# Altium project Kenwood-TS50s-Digi-Interface.PrjPcb
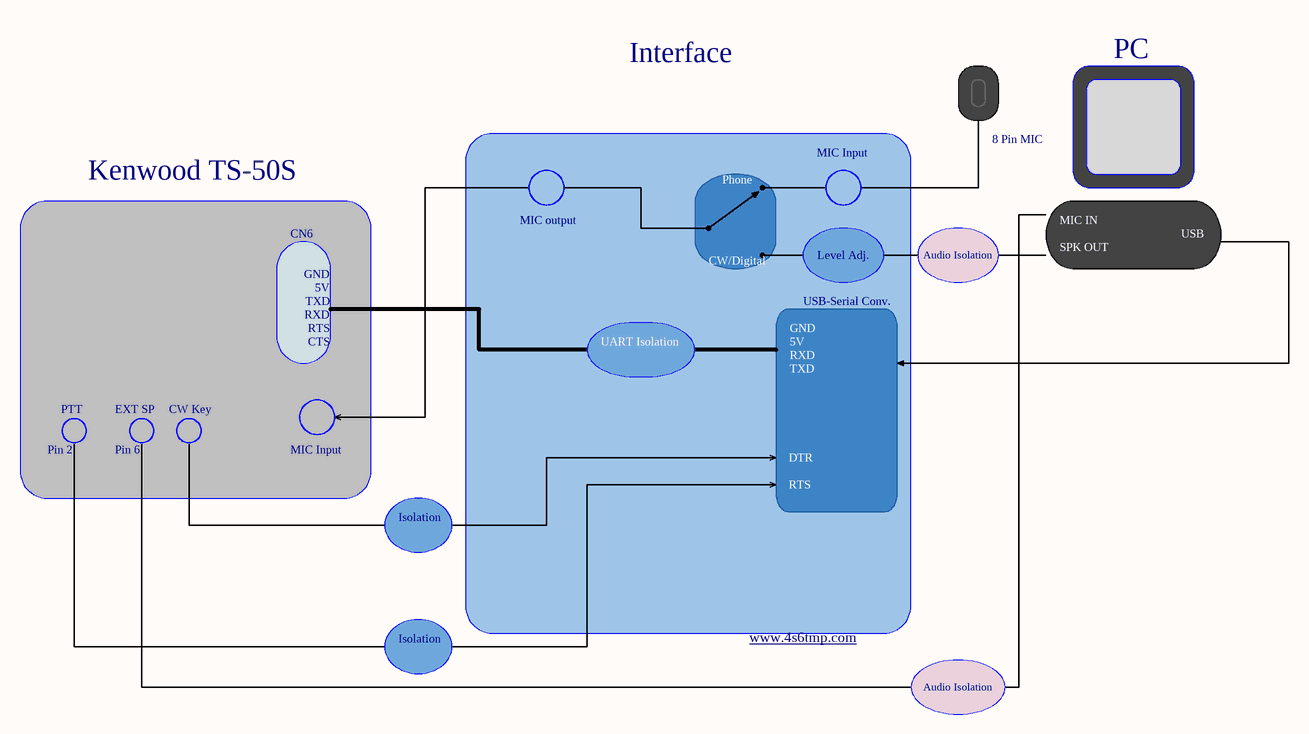
[diagram p0: Block Diagram.SchDoc]
4 sheets, 53 parts. Net scope: global (net labels, ports and power ports of the same name join across sheets).
Board files: ts-50s-digi-interface.PcbDoc, bottomplate.PcbDoc, faceplate.PcbDoc, PCB_panel.PcbDoc
Sheets:
  Block Diagram.SchDoc
  CAT-PTT.SchDoc
  Hardware.SchDoc
  ts-50s-digi-interface.SchDoc

## Sheet Block Diagram.SchDoc: Block Diagram
size A4; DocumentNumber: 1; Revision: 1; SheetNumber: 1; SheetTotal: 4

### Notes on the sheet
- Interface
- PC
- Kenwood TS-50S
- Phone
- MIC Input
- 8 Pin MIC
- CN6
- MIC output
- CW/Digital
- Level Adj.
- Audio Isolation
- MIC IN
- SPK OUT
- USB
- GND
- RXD
- TXD
- RTS
- 5V
- USB-Serial Conv.
- CTS
- UART Isolation
- Pin 2
- PTT
- EXT SP
- Pin 6
- CW Key
- DTR
- Isolation
- www.4s6tmp.com <http://www.4s6tmp.com>
- Title
- Size:
- Date:
- A4
- Number:
- Time:
- Revision:
- Sheet
- of
- File:

## Sheet CAT-PTT.SchDoc: TS50S USB CAT
size A4; DocumentNumber: 2; Revision: 1; SheetNumber: 2; SheetTotal: 4
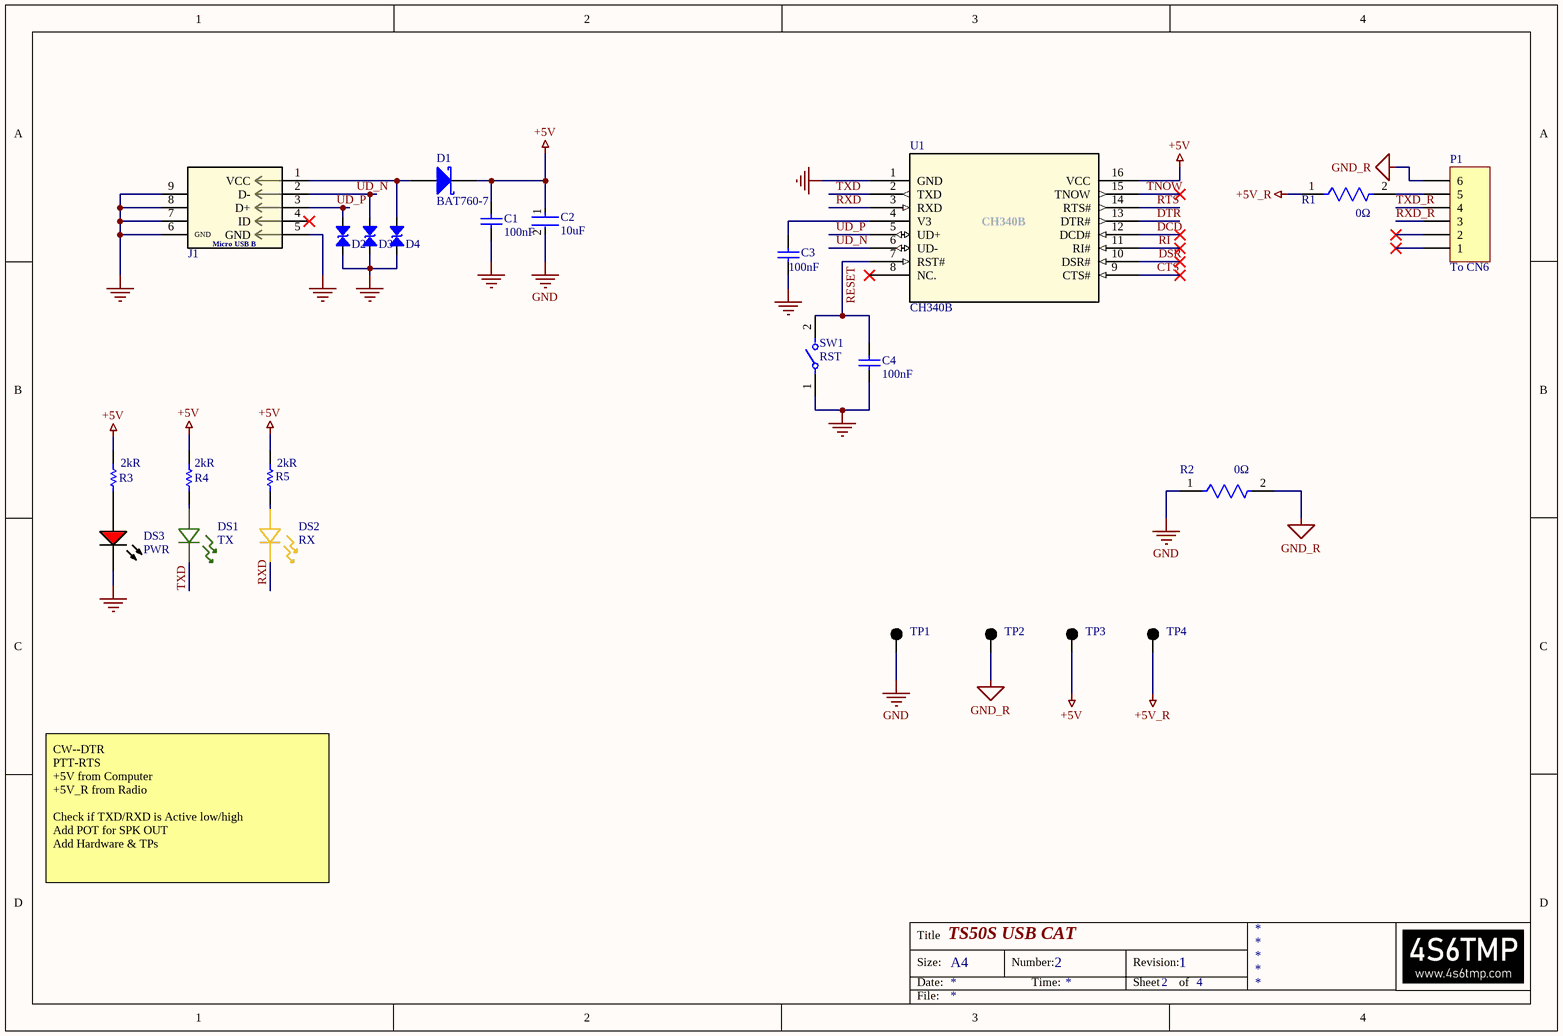
[diagram p1: CAT-PTT.SchDoc]

### Parts
C1  100nF  [CAPC1608X90X35ML10T15]
C2  10uF  [FP-GRM188-0_1-e0_2_0_55-IPC_A]
C3  100nF  [CAPC1608X90X35ML10T15]
C4  100nF  [CAPC1608X90X35ML10T15]
D1  BAT760-7  [SOD323_DIO]
D2  ESD Diode  [0603ESDA-05N]  (value not drawn)
D3  ESD Diode  [0603ESDA-05N]  (value not drawn)
D4  ESD Diode  [0603ESDA-05N]  (value not drawn)
DS1  TX  [LED_19-217/GHC-YR1S2/3T_EVE]
DS2  RX  [LED_19-217/GHC-YR1S2/3T_EVE]
DS3  PWR  [EVRL-0603-2_V]
J1  U254-051N-4BH806  [CONN_10103594-0001LF_AMP]  (value not drawn)
P1  To CN6  [HDR1X6]
R1  0Ω  [FP-RC0603-MFG]
R2  0Ω  [FP-RC0603-MFG]
R3  2kR  [RESC1608X55X25NL10T15]
R4  2kR  [RESC1608X55X25NL10T15]
R5  2kR  [RESC1608X55X25NL10T15]
SW1  RST  [FP-B3U-1000P-B-MFG]
TP1  GND  [KSTN-5001]  (value not drawn)
TP2  GND_R  [KSTN-5001]  (value not drawn)
TP3  +5V  [KSTN-5001]  (value not drawn)
TP4  +5V_R  [KSTN-5001]  (value not drawn)
U1  CH340B  [SOIC-16]

### Nets
+5V: C1.2 C2.1 D1.1(K) R3.2 R4.2 R5.2 TP3.1 U1.16(VCC)
+5V_R: R1.1 TP4.1
GND: C1.1 C2.2 C3.2 C4.1 D2.2 D3.2 D4.2 DS3.2(K) J1.5(GND) J1.6(GND) J1.7(GND) J1.8(GND) J1.9(GND) R2.1 SW1.1 TP1.1 U1.1(GND)
GND_R: P1.6 R2.2 TP2.1
CTS: U1.9(CTS#)
DCD: U1.12(DCD#)
DSR: U1.10(DSR#)
DTR: U1.13(DTR#)
RESET: C4.2 SW1.2 U1.7(RST#)
RI: U1.11(RI#)
RTS: U1.14(RTS#)
RXD: DS2.1 U1.3(RXD)
RXD_R: P1.3
TNOW: U1.15(TNOW)
TXD: DS1.1 U1.2(TXD)
TXD_R: P1.4
UD_N: D3.1 J1.2(D-) U1.6(UD-)
UD_P: D2.1 J1.3(D+) U1.5(UD+)
NetC3_1: C3.1 U1.4(V3)
NetD1_2: D1.2(A) D4.1 J1.1(VCC)
NetDS1_2: DS1.2 R4.1
NetDS2_2: DS2.2 R5.1
NetDS3_1: DS3.1(A) R3.1
NetP1_5: P1.5 R1.2

Not connected (* = marked no-connect by the designer): J1 4(ID)*; P1 1* 2*; U1 8(NC.)*

### Notes on the sheet
- CW--DTR
  PTT-RTS
  +5V from Computer
  +5V_R from Radio
  Check if TXD/RXD is Active low/high
  Add POT for SPK OUT
  Add Hardware & TPs
- Title
- Size:
- Date:
- A4
- Number:
- Time:
- Revision:
- Sheet
- of
- File:
- (in symbol U254-051N-4BH806) Micro USB B

### Library data of the parts
C1 C3 C4 = CMP-2006-02375-5: Chip Capacitor, 100 nF, +/- 10%, 50 V, -55 to 125 degC, 0603 (1608 Metric), RoHS, Tape and Reel; Manufacturer: Murata; Manufacturer Part Number: GCM188R71H104KA57D; Voltage Rating: 50 V; Dielectric: X7R; Voltage: 50V; Min Operating Temperature: -55 degC; ComponentLink1URL: http://www.murata.com/; PackageReference: 0603; Max Operating Temperature: 125 degC; ComponentLink1Description: Manufacturer URL; ComponentLink2Description: Datasheet; Packaging: Tape and Reel; PackageDescription: 2-Pin Surface Mount Device, Body 1.6 x 0.8 mm; Height: 0.8 mm; Mounting Technology: Surface Mount; Mount: Surface Mount; Length: 1.6 mm; ComponentLink2URL: http://psearch.en.murata.com/capacitor/product/GCM188R71H104KA57%23.pdf; Package Quantity: 4000; REACH SVHC: No SVHC; RoHSCompliant: true; DatasheetVersion: 07/2016; Supplier 1: Digi-Key; Supplier Part Number 1: 490-4779-1-ND; RoHS: Yes; Category: Ceramic Capacitors; Stock 1: 3146580; Pricing 1: 1=0.11000, 10=0.07900, 50=0.04300, 100=0.03510, 500=0.02510, 1000=0.01972 (USD); Case/Package: 0603; Case Code (Imperial): 0603; Case Code (Metric): 1608; Capacitance: 100nF; Tolerance: 10%; Termination: SMD/SMT; Voltage Rating (DC): 50V; Series: GCM; Construction: Flat; Width: 0.031inch; Thickness: 0.035inch; Depth: 0.8mm; Ratings: AEC-Q200; Radiation Hardening: No; Lead Free: Lead Free; RoHS Compliant: Yes; ComponentLink3URL: https://datasheet.ciiva.com/16624/product-16624562.pdf?src-supplier=Avnet+Europe; ComponentLink3Description: https://datasheet.ciiva.com/16624/product-16624562.pdf?src-supplier=Avnet+Europe; ComponentLink4URL: https://datasheet.ciiva.com/133/product-133574.pdf?src-supplier=Digi-Key; ComponentLink4Description: https://datasheet.ciiva.com/133/product-133574.pdf?src-supplier=Digi-Key; ComponentLink5URL: https://datasheet.ciiva.com/133/product-133575.pdf?src-supplier=Digi-Key; ComponentLink5Description: https://datasheet.ciiva.com/133/product-133575.pdf?src-supplier=Digi-Key; ComponentLink6URL: https://datasheet.ciiva.com/18183/getdatasheetpartid-98693-18183626.pdf?src-supplier=Verical; ComponentLink6Description: https://datasheet.ciiva.com/18183/getdatasheetpartid-98693-18183626.pdf?src-supplier=Verical; ComponentLink7URL: https://datasheet.ciiva.com/11786/0900766b80ef92d0-11786863.pdf?src-supplier=RSComponents; ComponentLink7Description: https://datasheet.ciiva.com/11786/0900766b80ef92d0-11786863.pdf?src-supplier=RSComponents; ComponentLink8URL: https://datasheet.ciiva.com/133/product-133573.pdf?src-supplier=Digi-Key; ComponentLink8Description: https://datasheet.ciiva.com/133/product-133573.pdf?src-supplier=Digi-Key; ComponentLink9URL: https://datasheet.ciiva.com/2989/product-2989242.pdf?src-supplier=Avnet; ComponentLink9Description: https://datasheet.ciiva.com/2989/product-2989242.pdf?src-supplier=Avnet; ComponentLink10URL: https://datasheet.ciiva.com/16497/product-16497247.pdf?src-supplier=Future+Electronics; ComponentLink10Description: https://datasheet.ciiva.com/16497/product-16497247.pdf?src-supplier=Future+Electronics
C2 = CMP-2006-02792-2: Chip Multilayer Ceramic Capacitors for General Purpose, 0603, 10uF, X5R, 15%, 20%, 6.3V; Packaging: Tape and Reel; Voltage Rating (DC): 6.3V; Width: 0.031inch; Termination: SMD/SMT; Dielectric: X5R; Package Quantity: 4000; Voltage Rating: 6.3V; Capacitance: 10uF; Case/Package: 0603; Min Operating Temperature: -55°C; Voltage: 6.3V; Length: 1.6mm; Thickness: 0.035inch; Lead Free: Lead Free; Depth: 0.8mm; Case Code (Imperial): 0603; Max Operating Temperature: 85°C; Material: Ceramic; Height: 0.8mm; Tolerance: 20%; Mount: Surface Mount; REACH SVHC: No SVHC; Radiation Hardening: No; Case Code (Metric): 1608
D1 = BAT760-7: 30V 1A 550mV @ 1A SOD-323 Schottky Barrier Diodes (SBD) RoHS; Supplier 1: Future Electronics; Supplier Part Number 1: 8129394; Manufacturer Product Number: BAT760-7; LCSC PN: C124187; Value: BAT760-7
D2-D4 = 0603ESDA-05N: Bidirectional - 50V - 5V 0603 ESD Protection Devices ROHS
DS1 = 19-217/GHC-YR1S2/3T: No Description Available; Vendor: Everlight Electronics; Built_By: EMA_Cory; SourceLibrary: Add_to_database_2021-02-25; Type: DEV; Colour: Green; Datasheet: https://media.digikey.com/pdf/Data%20Sheets/Everlight%20PDFs/19-217,GHC-YR1S2,3T.pdf; Manufacturer_Part_Number: 19-217/GHC-YR1S2/3T; Copyright: Copyright (C) 2018 Accelerated Designs. All rights reserved; RefDes: RefDes; Supplier 1: Digi-Key; Supplier Part Number 1: 19-217/GHC-YR1S2/3T-ND
DS2 = 19-217/Y5C-AP1Q2/3T: Yellow 590nm LED Indication - Discrete 2V 0603 (1608 Metric); Vendor: Everlight Electronics; SourceLibrary: Add_to_database_2021-02-25; Type: DEV; Manufacturer_Part_Number: 19-217/Y5C-AP1Q2/3T; RefDes: RefDes; Colour: Yellow; Supplier 1: Digi-Key; Supplier Part Number 1: 19-217/Y5C-AP1Q2/3T-ND
DS3 = CMP-2100-03578-1: Chip LED, Red, 5 V, 25 mA, -40 to 85 degC, 2-Pin SMD (0603), RoHS, Tape and Reel; Manufacturer: Everlight Electronics; Forward Voltage: 2.2V; Lens Style: Clear; Package Reference: 0603; Case/Package: 0603; RoHSCompliant: false; Package Description: 2-Pin Surface Mount Device, Body 1.6 x 0.8 mm; Colour: Red; Lead Free: LeadFree; Datasheet URL: https://datasheet.ciiva.com/4688/el-19-217-r6c-al1m2vy-3tpdf-187026-4688713.pdf; Manufacturer URL: http://www.everlight.com/; Datasheet Version: Rev. 1, 01/2005
J1 = U254-051N-4BH806: USB - Micro B Female USB 2 5 SMD USB Connectors RoHS; Vendor: XKB Connectivity; Datasheet: https://datasheet.lcsc.com/lcsc/2107141638_XKB-Connectivity-U254-051N-4BH806_C319170.pdf; Manufacturer_Part_Number: U254-051N-4BH806; RefDes: RefDes; Type: DEV
P1 = Header 6: Header, 6-Pin; LatestRevisionDate: 17-Jul-2002; LatestRevisionNote: Re-released for DXP Platform.; Publisher: Altium Limited
R1 = CMP-2000-06925-2: RES SMD 0 OHM JUMPER 1/10W 0603; Manufacturer: Yageo; Manufacturer Part Number: RC0603FR-070RL; Tolerance: 1%; Power Rating: 0.1W; Voltage Rating: 75V; Composition: Thick Film; Temperature Range Low: -55°C; Ipc Land Pattern Name: RESC16080X45; Lead Free: Yes; Digikey Description: RES SMD 0 OHM JUMPER 1/10W 0603; Height: 0.55mm; Automotive: No; Device Class L3: Chip SMD Resistors; Device Class L1: Passive Components; Device Class L2: Resistors; Footprint Url: http://www.yageo.com/exep/pages/download/literatures/PYu-R_Mount_10.pdf; Category: Res; Mouser Description: RC Series 0603 0.1 W 0 O Jumper Surface Mount Thick Film Chip Resistor; Value: 0Ω; Resistance: 0Ω; ComponentLink2URL: http://www.yageo.com/documents/recent/PYu-RC_Group_51_RoHS_L_10.pdf; Series: RC_L; ComponentLink2Description: Datasheet; RoHS: TRUE; Temperature: -55°C to +155°C; Temperature Range High: +155°C; Package: RC0603; Octopart: https://octopart.com/rc0603fr-070rl-yageo-1180803
R2 = CMP-2000-06925-2: DNP; Manufacturer: Yageo; Manufacturer Part Number: RC0603FR-070RL; Tolerance: 1%; Power Rating: 0.1W; Voltage Rating: 75V; Composition: Thick Film; Temperature Range Low: -55°C; Ipc Land Pattern Name: RESC16080X45; Lead Free: Yes; Digikey Description: RES SMD 0 OHM JUMPER 1/10W 0603; Height: 0.55mm; Automotive: No; Device Class L3: Chip SMD Resistors; Device Class L1: Passive Components; Device Class L2: Resistors; Footprint Url: http://www.yageo.com/exep/pages/download/literatures/PYu-R_Mount_10.pdf; Category: Res; Mouser Description: RC Series 0603 0.1 W 0 O Jumper Surface Mount Thick Film Chip Resistor; Value: 0Ω; Resistance: 0Ω; ComponentLink2URL: http://www.yageo.com/documents/recent/PYu-RC_Group_51_RoHS_L_10.pdf; Series: RC_L; ComponentLink2Description: Datasheet; RoHS: TRUE; Temperature: -55°C to +155°C; Temperature Range High: +155°C; Package: RC0603; Octopart: https://octopart.com/rc0603fr-070rl-yageo-1180803
R3-R5 = CMP-2000-04259-1: Part Number: RC0603JR-072KL; Manufacturer: Yageo; Tolerance: 5%; Temperature Coefficient: 100ppm/°C; Voltage Rating (DC): 50V; Power Rating: 100mW; Supplier 1: Digi-Key; Supplier Part Number 1: 311-2.0KGRCT-ND; Manufacturer Part Number: RC0603JR-072KL; RoHS: Yes; Category: Chip SMD Resistors; Stock 1: 288847; Pricing 1: 1=0.10000, 10=0.02000, 100=0.00800, 1000=0.00360, 2500=0.00312 (USD); Case/Package: 0603; Number of Pins: 2; Case Code (Imperial): 0603; Case Code (Metric): 1608; Size Code: 0603; Min Operating Temperature: -55°C; Max Operating Temperature: 155°C; Resistance: 2kR; Resistor Type: Thick Film; Packaging: Tape and Reel; Voltage Rating: 50V; Termination: SMD/SMT; Features: Moisture Resistant; Series: RC; Max Power Dissipation: 100mW; Number of Terminations: 2; Resistance Tolerance: 5%; Construction: Rectangular; Length: 1.6mm; Depth: 0.8mm; Lead Free: Lead Free; REACH SVHC: No SVHC; Military Standard: Not; RoHS Compliant: Yes; ComponentLink1URL: https://datasheet.ciiva.com/46395/443971-46395143.pdf?src-supplier=Element14; ComponentLink1Description: https://datasheet.ciiva.com/46395/443971-46395143.pdf?src-supplier=Element14
SW1 = CMP-08834-000005-1: SWITCH TACTILE SPST-NO 0.05A 12V; Manufacturer Part Number: B3U-1000P-B; Manufacturer: Omron; Operating Force: 1.5N; Contact Current Rating: 50mA; Contact Resistance: 100mΩ; Electromechanical Life: 200000Cycles; Height: 1.75mm; Device Class L2: Switches; Temperature Range High: +70°C; Digikey Description: SWITCH TACTILE SPST-NO 0.05A 12V; Throw Configuration: SPST-NO; Ambient Temperature Range High: +70°C; Temperature: -25°C to +70°C; Lead Free: Yes; ComponentLink2URL: https://omronfs.omron.com/en_US/ecb/products/pdf/en-b3u.pdf; Device Class L3: Tactile Switches; Ambient Temperature Range Low: -25°C; Mount: Surface Mount; Automotive: No; Mouser Description: Tactile Switches Top Actuated with boss w/o ground; Octopart: https://octopart.com/b3u-1000p-b-omron-1057356; RoHS: TRUE; Package: 0; Device Class L1: Electromechanical; Voltage Rating Dc: 12V; Category: Switch; Temperature Range Low: -25°C; ComponentLink2Description: Datasheet
TP1-TP4 = CMP-2000-05181-1: Test Point, Black, 1-Pin THD, RoHS, Bulk; Manufacturer: Keystone; Other Names: 5001K; Catalog Drawings: 5000Series; Alternate Color: 5004K-ND / -TESTPOINTPCMINI.040"DYELLOW / 5003K-ND / -TESTPOINTPCMINI.040"DORANGE / 5002K-ND / -TESTPOINTPCMINI.040"DWHITE / 5000K-ND / -TESTPOINTPCMINI.040"DRED; Kits: DKTGRS232C-KIT-ND / -TTLCONVERTER; Online Catalog: ColorCodedTestPoints; Datasheet URL: https://ciiva.com/datasheet-click-2917627?src=ciiva&sig=bd195616; Mounting Type: 0.040"(1.02mm)HoleDiameter; Family: TestPoints; RoHS Information: RoHSComplianceStatement; Datasheet Version: Rev. G, 12/2008; Color: Black; Category: TestandMeasurement; Standard Package: 100; Manufacturer URL: http://www.keyelco.com/; Material: Base,Nylon46,UL94V-0; Type: PCTestPoint,Miniature; Terminal: 0.010"x0.020"(0.25mmx0.51mm)PhosphorBronzeWire,SilverPlated; Series: THM; Packaging: Bulk
U1 = CH340B: Transceiver USB 2.0 2Mbps SOP-16_150mil USB ICs RoHS; Vendor: WCH; Datasheet: https://datasheet.lcsc.com/lcsc/2107141453_WCH-Jiangsu-Qin-Heng-CH340B_C81010.pdf; Manufacturer_Part_Number: CH340B; RefDes: RefDes; Type: DEV; ComponentLink1Description: LCSC; ComponentLink1URL: https://lcsc.com/product-detail/USB-ICs_WCH-Jiangsu-Qin-Heng-CH340B_C81010.html

## Sheet Hardware.SchDoc: Hardware
size A4; DocumentNumber: 4; Revision: 1; SheetNumber: 4; SheetTotal: 4
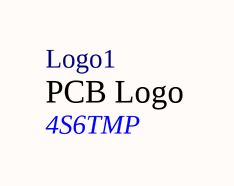
[diagram p2: Hardware.SchDoc]

### Parts
Logo1  4S6TMP Logo  [4S6TMP Logo]  (value not drawn)  (no BOM)

### Notes on the sheet
- Title
- Size:
- Date:
- A4
- Number:
- Time:
- Revision:
- Sheet
- of
- File:
- (in symbol 4S6TMP-logo) PCB Logo; 4S6TMP

### Library data of the parts
Logo1 = 4S6TMP-logo: Codeverto Logo

## Sheet ts-50s-digi-interface.SchDoc: Kenwood TS50s Digital Interface
size A4; Organization: 4S6TMP; Address1: Sri Lanka; DocumentNumber: 3; Revision: 1.0; SheetNumber: 3; SheetTotal: 4
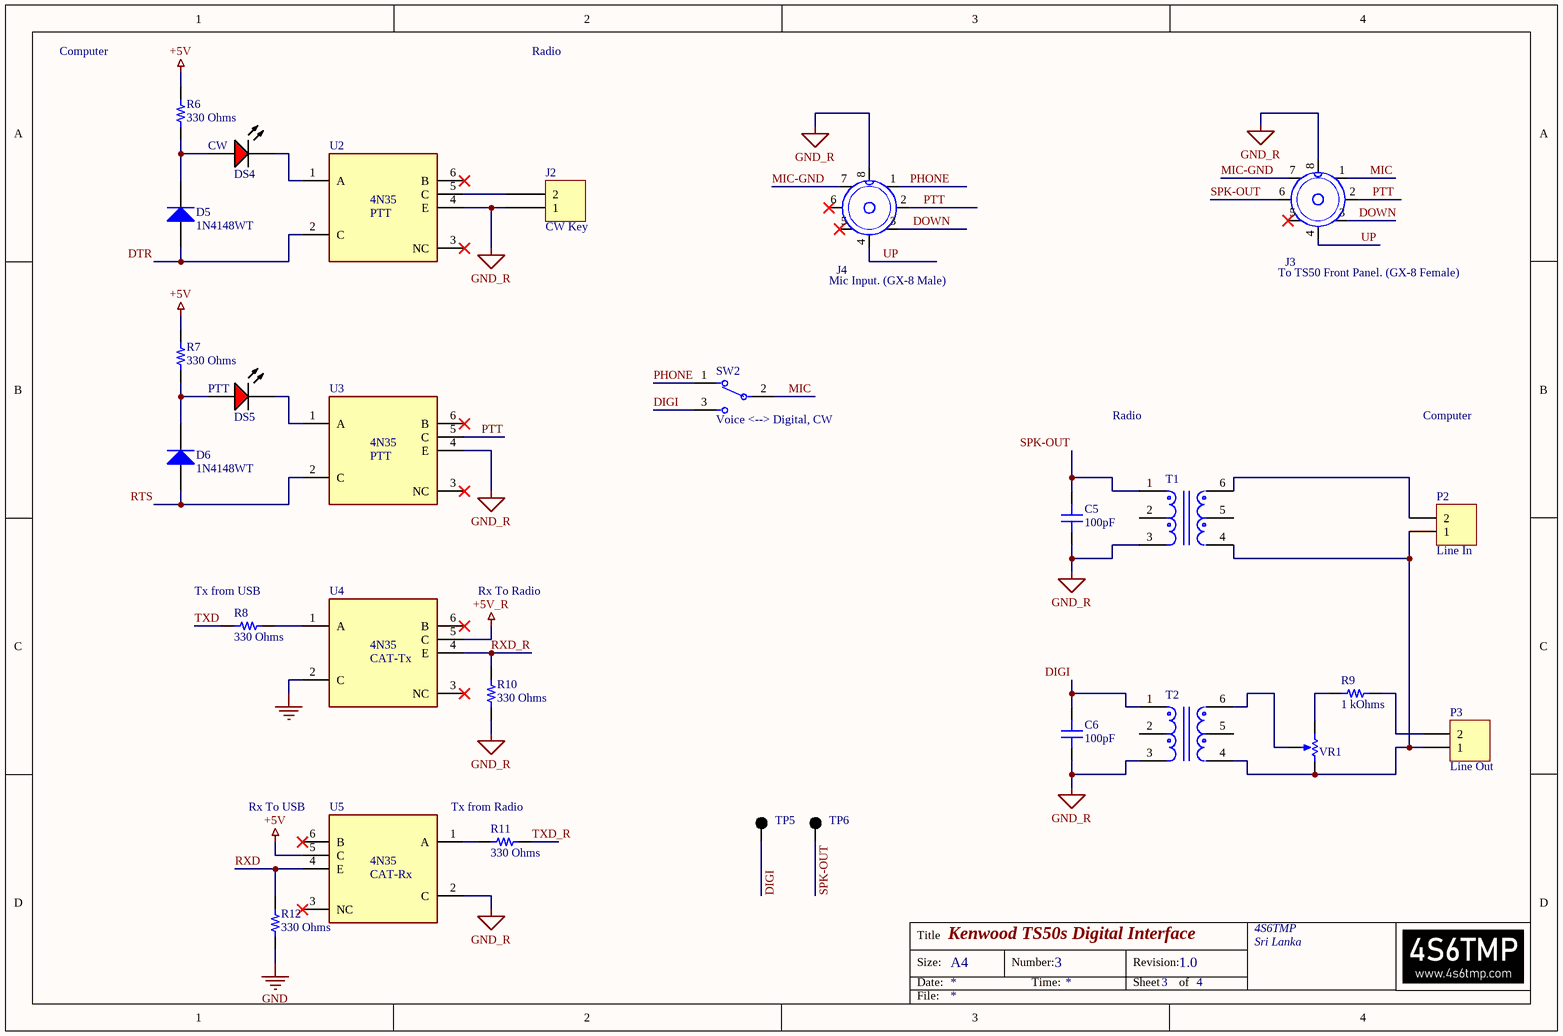
[diagram p3: ts-50s-digi-interface.SchDoc]

### Parts
C5  100pF  [CAP 0603_1608]
C6  100pF  [CAP 0603_1608]
D5  1N4148WT  [FAIR-SOD-523F-2_V]
D6  1N4148WT  [FAIR-SOD-523F-2_V]
DS4  CW  [AVAG-HLMP-3301-2]
DS5  PTT  [AVAG-HLMP-3301-2]
J2  CW Key  [MOLEX KK 0022272021]
J3  To TS50 Front Panel. (GX-8 Female)  [GX-8]
J4  Mic Input. (GX-8 Male)  [GX-8]
P2  Line In  [HDR1X2]
P3  Line Out  [HDR1X2]
R6  330 Ohms  [RES 0603_1608]
R7  330 Ohms  [RES 0603_1608]
R8  330 Ohms  [RES 0603_1608]
R9  1 kOhms  [RES 0603_1608]
R10  330 Ohms  [RES 0603_1608]
R11  330 Ohms  [RES 0603_1608]
R12  330 Ohms  [RES 0603_1608]
SW2  Voice <--> Digital, CW  [FP-A101SDCQ04-MFG]
T1  SM-LP-5001  [SM-LP-5001]  (value not drawn)
T2  SM-LP-5001  [SM-LP-5001]  (value not drawn)
TP5  DIGI  [KSTN-5001]  (value not drawn)
TP6  SPK OUT  [KSTN-5001]  (value not drawn)
U2  PTT  Part Number: 4N35  [Vishay_4N35_0]
U3  PTT  Part Number: 4N35  [Vishay_4N35_0]
U4  CAT-Tx  Part Number: 4N35  [Vishay_4N35_0]
U5  CAT-Rx  Part Number: 4N35  [Vishay_4N35_0]
VR1  3852A-282-103AL  [BOUR-3852A-282-103AL-3_V]  (value not drawn)

### Nets
+5V: R6.2 R7.2 U5.5(C)
+5V_R: U4.5(C)
GND: R12.2 U4.2(C)
GND_R: C5.1 C6.1 J2.1 J3.8 J4.8 R10.2 T1.3 T2.3 U2.4(E) U3.4(E) U5.2(C)
DIGI: C6.2 SW2.3 T2.1 TP5.1
DOWN: J3.3 J4.3
DTR: D5.2(A) U2.2(C)
MIC: J3.1 SW2.2
MIC-GND: J3.7 J4.7
PHONE: J4.1 SW2.1
PTT: J3.2 J4.2 U3.5(C)
RTS: D6.2(A) U3.2(C)
RXD: R12.1 U5.4(E)
RXD_R: R10.1 U4.4(E)
SPK-OUT: C5.2 J3.6 T1.1 TP6.1
TXD: R8.2
TXD_R: R11.1
UP: J3.4 J4.4
NetD5_1: D5.1(K) DS4.2(A) R6.1
NetD6_1: D6.1(K) DS5.2(A) R7.1
NetDS4_1: DS4.1(K) U2.1(A)
NetDS5_1: DS5.1(K) U3.1(A)
NetJ2_2: J2.2 U2.5(C)
NetP2_1: P2.1 P3.1 T1.4 T2.4 VR1.3(CW)
NetP2_2: P2.2 T1.6
NetP3_2: P3.2 R9.2
NetR8_1: R8.1 U4.1(A)
NetR9_1: R9.1 VR1.1(CCW)
NetR11_2: R11.2 U5.1(A)
NetT2_6: T2.6 VR1.2(S)

Not connected (* = marked no-connect by the designer): J3 5*; J4 5* 6*; T1 2 5; T2 2 5; U2 3(NC)* 6(B)*; U3 3(NC)* 6(B)*; U4 3(NC)* 6(B)*; U5 3(NC)* 6(B)*

### Notes on the sheet
- Computer
- Radio
- (near R8) Tx from USB
- (near U4) Rx To Radio
- (near U5) Rx To USB
- Tx from Radio
- Title
- Size:
- Date:
- A4
- Number:
- Time:
- Revision:
- Sheet
- of
- File:

### Library data of the parts
C5 C6 = 500R14N101JV4T: CAP CER 100PF 50V C0G/NP0 0603; Manufacturer: Johanson Dielectrics Inc.; Temperature Coefficient: C0G, NP0; Tolerance: ±5%; Part Number: 500R14N101JV4T; Value: 100pF; Applications: General Purpose; Capacitance: 100pF; ComponentLink1Description: Datasheet; ComponentLink1URL: https://www.johansondielectrics.com/downloads/catalog/johanson-dielectrics-product-catalog.pdf; ComponentLink2Description: DigiKey Link; ComponentLink2URL: http://digikey.com/product-detail/en/johanson-dielectrics-inc/500R14N101JV4T/709-1147-1-ND/1859479; Device Package: 0603 (1608 Metric); LastUpdated: 02/09/2020 01:03:11; Lifecycle Status: Active; Minimum Order: 1; Mounting Type: Surface Mount, MLCC; Operating Temperature: -55°C ~ 125°C; Package / Case: 0603 (1608 Metric); Packaging: TapeAndReel; PartId: 15143; Part Status: Active; Price: 0.08; Series: -; Size / Dimension: 0.063" L x 0.032" W (1.60mm x 0.81mm); Supplier 1: DigiKey; Supplier Part Number 1: 709-1147-1-ND; Thickness (Max): 0.035" (0.89mm); Voltage - Rated: 50V
D5 D6 = CMP-0881-00001-1: High Conductance Fast Switching Diode, 75 V, -55 to 150 degC, 2-Pin SOD523F, RoHS; Manufacturer: Fairchild Semiconductor; IR (VR: 75 V)=5 uA Max.; VF: 1 V Max.; BVR (IR: 5 uA)=75 V Min.; CO: 4 pF Max.; DatasheetVersion: Rev. A2; ComponentLink1Description: Manufacturer URL; PackageDescription: 2-Pin Surface Mount Device, Body 1.2 x 0.8 mm, Height 0.7 mm; ComponentLink2URL: http://www.fairchildsemi.com/ds/1N/1N4148WT.pdf; ComponentLink2Description: Datasheet; PartNumber: 1N4148WT; ComponentLink1URL: http://www.fairchildsemi.com/; Temperature Range: -55 to 150 degC; Mounting Technology: Surface Mount; PackageReference: SOD-523F-2; RoHS: TRUE
DS4 DS5 = CMP-2000-06411-1: T-1 3/4 (5 mm) Diffused LED Lamp, 1.9 V, -40 to 100 degC, 2-Pin THD, RoHS, Bulk; Manufacturer: Avago; Forward Current: 25mA; Forward Voltage: 2.4V; Peak Wavelength: 635nm; Shape Type: Circular; High Brightness: No; Main Category: StandardLED; Test Current (It): 10mA; Dominant Wave Length: 626nm; Number of  Elements: 1; Reverse Voltage: 5V; Chip Material: GaP; Product Height (mm): 9.19mm; Lens Type: ColoredDiffused; Viewing Angle: 60deg; Type: Uni-Color; Emitting Color: Red; Luminous Intensity: 5.4mcd; Power Dissipation: 85W; DELETED: Compliant; Product Depth (mm): 6.1mm; Package Description: 2-Pin Through Hole LED, Dia 5.85 mm; Mounting Technology: ThroughHole; Manufacturer URL: http://www.avagotech.com/; Package Type: T-13/4; Operating Temp Range: -40Cto100C; Datasheet URL: http://www.avagotech.com/docs/AV02-1558EN; Mounting: ThroughHole; Lens Dimensions: 5.08x5.08x8.3mm; Package Reference: HLMP-3301; Datasheet Version: 03/2015; Pin Count: 2; Packaging: TapeandReel; Operating Temperature Classification: Industrial; Lum Intensity: 5.4mcd; Rad Hardened: No; Product Length (mm): 6.1mm
J2 = 0022272021: CONN HEADER VERT 2POS 2.54MM; Manufacturer: Molex; Contact Length - Mating: 0.295" (7.49mm); Contact Length - Post: 0.140" (3.56mm); Material Flammability Rating: UL94 V-0; Number of Positions: 2; Number of Positions Loaded: All; Overall Contact Length: 0.560" (14.22mm); Pitch - Mating: 0.100" (2.54mm); Shrouding: Shrouded - 1 Wall; Style: Board to Cable/Wire; Part Number: 0022272021; ComponentLink1Description: Datasheet; ComponentLink1URL: https://www.molex.com/pdm_docs/sd/022272021_sd.pdf; ComponentLink2Description: DigiKey Link; ComponentLink2URL: http://digikey.com/product-detail/en/molex/0022272021/WM4111-ND/1130577; Connector Type: Header; Contact Finish - Mating: Tin; Contact Finish - Post: Tin; Contact Finish Thickness - Mating: 100.0µin (2.54µm); Contact Material: Brass; Contact Shape: Square; Contact Type: Male Pin; Fastening Type: Friction Lock; Insulation Color: Natural; Insulation Height: 0.461" (11.70mm); Insulation Material: Polyamide (PA), Nylon; LastUpdated: 12/01/2020 23:51:43; Lifecycle Status: Active; Minimum Order: 1; Mounting Type: Through Hole; Number of Rows: 1; Packaging: Bulk; PartId: 76; Part Status: Active; Price: 0.27; Series: KK 6410; Supplier 1: DigiKey; Supplier Part Number 1: WM4111-ND; Termination: Solder
J3 J4 = GX-8: 8 Position Circular Connector Receptacle, Male Pins Solder; Manufacturer: Amphenol Tuchel Industrial; Manufacturer Product Number: C09131W0081002U; ComponentLink1Description: Manufacturer Link; ComponentLink1URL: https://www.digikey.com/en/products/detail/amphenol-tuchel-industrial/C09131W0081002U/1036183; ComponentLink2Description: Datasheet; ComponentLink2URL: http://www.amphenol-sine.com/pdf/catalog/C091.pdf
P2 P3 = Header 2: 3.5mm Mono; LatestRevisionDate: 17-Jul-2002; LatestRevisionNote: Re-released for DXP Platform.; Publisher: Altium Limited
R6-R8 R10-R12 = AC0603FR-07330RL: RES SMD 330 OHM 1% 1/10W 0603; Manufacturer: Yageo; Power (Watts): 0.1W, 1/10W; Temperature Coefficient: ±100ppm/°C; Part Number: AC0603FR-07330RL; Value: 330 Ohms; ComponentLink1Description: Datasheet; ComponentLink1URL: https://www.yageo.com/upload/media/product/productsearch/datasheet/rchip/PYu-AC_51_RoHS_L_7.pdf; ComponentLink2Description: DigiKey Link; ComponentLink2URL: http://digikey.com/product-detail/en/yageo/AC0603FR-07330RL/YAG3595CT-ND/6006444; Composition: Thick Film; Device Package: 0603 (1608 Metric); Features: Automotive AEC-Q200, Moisture Resistant; Height - Seated (Max): 0.022" (0.55mm); LastUpdated: 02/09/2020 01:09:46; Lifecycle Status: Active; Minimum Order: 1; Number of Terminations: 2; Operating Temperature: -55°C ~ 155°C; Package / Case: 0603 (1608 Metric); Packaging: CutTape; PartId: 22572; Part Status: Active; Price: 0.10; Ratings: AEC-Q200; Resistance: 330 Ohms; Series: AC; Size / Dimension: 0.063" L x 0.031" W (1.60mm x 0.80mm); Supplier 1: DigiKey; Supplier Part Number 1: YAG3595CT-ND; Supplier Device Package: 0603; Tolerance: ±1%
R9 = AT0603FRE071KL: RES SMD 1K OHM 1% 1/10W 0603; Manufacturer: Yageo; Power (Watts): 0.1W, 1/10W; Temperature Coefficient: ±50ppm/°C; Part Number: AT0603FRE071KL; Value: 1 kOhms; ComponentLink1Description: Datasheet; ComponentLink1URL: http://www.yageo.com/documents/recent/PYu-AT_51_RoHS_L_5.pdf; ComponentLink2Description: DigiKey Link; ComponentLink2URL: http://digikey.com/product-detail/en/yageo/AT0603FRE071KL/YAG2125CT-ND/5139573; Composition: Thin Film; Device Package: 0603 (1608 Metric); Features: Anti-Sulfur, Automotive AEC-Q200, Moisture Resistant; Height - Seated (Max): 0.022" (0.55mm); LastUpdated: 02/09/2020 01:10:12; Lifecycle Status: Active; Minimum Order: 1; Number of Terminations: 2; Operating Temperature: -55°C ~ 155°C; Package / Case: 0603 (1608 Metric); Packaging: TapeAndReel; PartId: 11376; Part Status: Active; Price: 0.02; Ratings: AEC-Q200; Resistance: 1 kOhms; Series: AT; Size / Dimension: 0.063" L x 0.031" W (1.60mm x 0.80mm); Supplier 1: DigiKey; Supplier Part Number 1: YAG2125CT-ND; Supplier Device Package: 0603; Tolerance: ±1%
SW2 = CMP-03408-000002-1: SWITCH TOGGLE SPDT 5A 120V; Contact Resistance: 10mR; Actuator Length: 12.19mm; Actuator Material: Phenolic; Mount: PCB; Case/Package: 125; Contact Material: Copper; Termination: Through Hole; Contact Current Rating: 5A; Package Quantity: 100; Max Operating Temperature: 85°C; Series: Gemini A; Min Operating Temperature: -30°C; Throw Configuration: SPDT
T1 T2 = CMP-07264-000002-1: TRANSFORMER LINE MATCHING SMD
TP5 TP6 = CMP-2000-05181-1: as TP1 on sheet CAT-PTT; Datasheet URL: https://ciiva.com/datasheet-click-2917627?src=ciiva&sig=bd195616; Mounting Type: 0.040"(1.02mm)HoleDiameter; Family: TestPoints; RoHS Information: RoHSComplianceStatement; Datasheet Version: Rev. G, 12/2008; Color: Black; Category: TestandMeasurement; Standard Package: 100; Manufacturer URL: http://www.keyelco.com/; Material: Base,Nylon46,UL94V-0; Type: PCTestPoint,Miniature; Terminal: 0.010"x0.020"(0.25mmx0.51mm)PhosphorBronzeWire,SilverPlated; Series: THM; Packaging: Bulk
U2-U5 = IC_Vishay_4N35_eec: IC OPTOISO 5KV TRANS W/BASE 6DIP; Manufacturer: Vishay; helpURL: https://upverter.com/upn/revision/7474c0fadec3a473/; ComponentLink2Description: Datasheet; Temperature: -55°C to +100°C; Package: 4N35; Supplier 2: Mouser; Price: 0.32203113639; Supplier 1: Digi-Key; ComponentLink1URL: https://upverter.com/upn/revision/7474c0fadec3a473/; Supplier Part Number 2: 78-4N35; Supplier Part Number 1: 4N35-ND; ComponentLink1Description: Upverter; ComponentLink2URL: https://www.vishay.com/docs/81181/4n35.pdf; RoHS: TRUE; Mouser Part Number: 78-4N35; Ipc Land Pattern Name: DIP762W50P254L712H450Q6; Temperature Range High: +100°C; Digikey Description: IC OPTOISO 5KV TRANS W/BASE 6DIP; Digikey Part Number: 4N35-ND; Lead Free: yes; Mfg Package Ident: 4N35; Temperature Range Low: -55°C
VR1 = CMP-2000-05079-1: Diameter Panel Control, 100 KOhm, +/- 10%, 2 W, -1 to 125 degC, 3-Pin THD, RoHS, Bulk; Manufacturer: Bourns; Temperature Coefficient: ±150ppm/degC; Number of Gangs: 1; Other Names: 3852A282103AL; Actuator Length: 0.875"(22.23mm); Resistive Material: Cermet; PCN Design/Specification: PBTResinJun/2011; Rotation: 280deg; PCN Other: MultipleChanges01/Dec/2012; Catalog Drawings: 3852SeriesSide1 / 3852SeriesSide2; Online Catalog: 3852and3856Series; Associated Product: 36-8560-ND / -KNOBINSTRUMW/DIALRND.9"DIA / 36-8555-ND / -KNOBINSTRUMSKIRTEDRND.7"DIA / 36-8556-ND / -KNOBINSTRUMSKIRTEDRND.9"DIA / 36-8565-ND / -KNOBINSTRUMDBLBARRND.7"DIA / 36-8566-ND / -KNOBINSTRUMDBLBARRND.9"DIA / 36-8568-ND / -KNOBINSTRUMSGLBARRND.7"DIA / 36-8569-ND / -KNOBINSTRUMSGLBARRND.9"DIA / 36-8559-ND / -KNOBINSTRUMW/DIALRND.7"DIA / 226-1006-ND / -KNOBBLKGLOSS.75"DIA.250"SHAFT / 226-1007-ND / -KNOBBLKGLOSS.925"DIA.250"SHAFT / 226-1011-ND / -KNOBBLKGLOS; Actuator Diameter: 0.250"(6.35mm); Built in Switch: None; Resistance (Ohms): 100k; Power (Watts): 2W; Actuator Type: Slotted; Standard Package: 45; Tolerance: ±10%; Taper: Linear; Series: 3852; Packaging: Bulk; Category: Potentiometers,VariableResistors; Bushing Thread: 3/8-32; Datasheet URL: https://datasheet.ciiva.com/11831/0900766b80f93b4b-11831016.pdf; Datasheet Version: Sep-14; Number of Turns: 1; Family: RotaryPotentiometers,Rheostats; Termination Style: SolderLug; RoHS Information: 3852A-LMaterialDeclaration; Mounting Type: PanelMount; Manufacturer URL: http://www.bourns.com/

## Nets that join several sheets
+5V: CAT-PTT (8 pins), ts-50s-digi-interface (R6.2 R7.2 U5.5)
+5V_R: CAT-PTT (R1.1 TP4.1), ts-50s-digi-interface (U4.5)
GND: CAT-PTT (17 pins), ts-50s-digi-interface (R12.2 U4.2)
GND_R: CAT-PTT (P1.6 R2.2 TP2.1), ts-50s-digi-interface (11 pins)
DTR: CAT-PTT (U1.13), ts-50s-digi-interface (D5.2 U2.2)
RTS: CAT-PTT (U1.14), ts-50s-digi-interface (D6.2 U3.2)
RXD: CAT-PTT (DS2.1 U1.3), ts-50s-digi-interface (R12.1 U5.4)
RXD_R: CAT-PTT (P1.3), ts-50s-digi-interface (R10.1 U4.4)
TXD: CAT-PTT (DS1.1 U1.2), ts-50s-digi-interface (R8.2)
TXD_R: CAT-PTT (P1.4), ts-50s-digi-interface (R11.1)